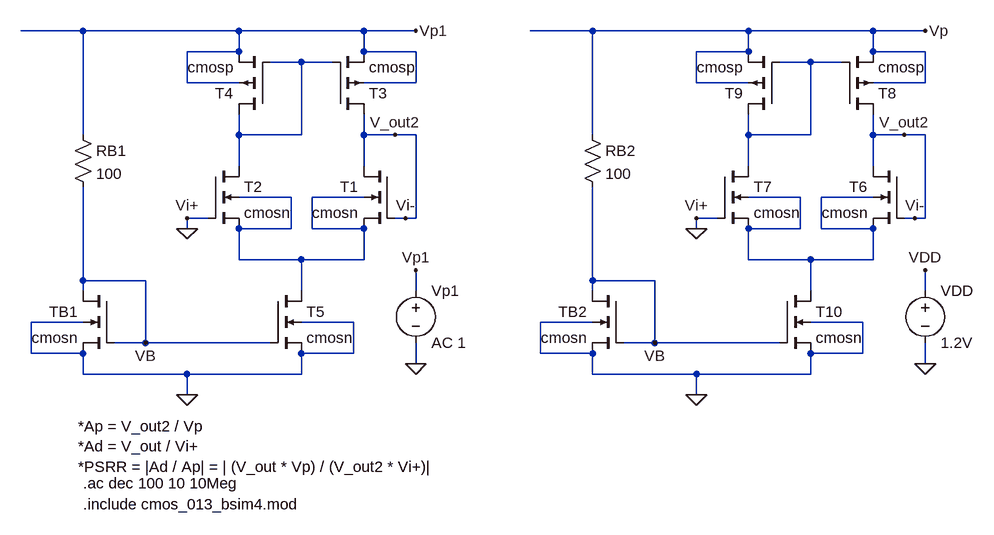
[diagram p0: schematic Draft1.asc]
Draft1.asc, the LTspice schematic file:
Version 4
SHEET 1 1296 680
WIRE -128 -224 -224 -224
WIRE 112 -224 -128 -224
WIRE 304 -224 112 -224
WIRE 384 -224 304 -224
WIRE 656 -224 560 -224
WIRE 896 -224 656 -224
WIRE 1088 -224 896 -224
WIRE 1168 -224 1088 -224
WIRE 112 -192 112 -224
WIRE 112 -192 32 -192
WIRE 304 -192 304 -224
WIRE 384 -192 304 -192
WIRE 896 -192 896 -224
WIRE 896 -192 816 -192
WIRE 1088 -192 1088 -224
WIRE 1168 -192 1088 -192
WIRE 208 -176 160 -176
WIRE 256 -176 208 -176
WIRE 992 -176 944 -176
WIRE 1040 -176 992 -176
WIRE 32 -144 32 -192
WIRE 112 -144 32 -144
WIRE 384 -144 384 -192
WIRE 384 -144 304 -144
WIRE 816 -144 816 -192
WIRE 896 -144 816 -144
WIRE 1168 -144 1168 -192
WIRE 1168 -144 1088 -144
WIRE -128 -64 -128 -224
WIRE 112 -64 112 -96
WIRE 208 -64 208 -176
WIRE 208 -64 112 -64
WIRE 304 -64 304 -96
WIRE 352 -64 304 -64
WIRE 384 -64 352 -64
WIRE 656 -64 656 -224
WIRE 896 -64 896 -96
WIRE 992 -64 992 -176
WIRE 992 -64 896 -64
WIRE 1088 -64 1088 -96
WIRE 1136 -64 1088 -64
WIRE 1168 -64 1136 -64
WIRE 112 -16 112 -64
WIRE 304 -16 304 -64
WIRE 896 -16 896 -64
WIRE 1088 -16 1088 -64
WIRE 192 32 112 32
WIRE 304 32 224 32
WIRE 976 32 896 32
WIRE 1088 32 1008 32
WIRE 64 64 32 64
WIRE 368 64 352 64
WIRE 384 64 384 -64
WIRE 384 64 368 64
WIRE 848 64 816 64
WIRE 1152 64 1136 64
WIRE 1168 64 1168 -64
WIRE 1168 64 1152 64
WIRE 32 80 32 64
WIRE 192 80 192 32
WIRE 192 80 112 80
WIRE 224 80 224 32
WIRE 304 80 224 80
WIRE 816 80 816 64
WIRE 976 80 976 32
WIRE 976 80 896 80
WIRE 1008 80 1008 32
WIRE 1088 80 1008 80
WIRE 112 128 112 80
WIRE 208 128 112 128
WIRE 304 128 304 80
WIRE 304 128 208 128
WIRE 896 128 896 80
WIRE 992 128 896 128
WIRE 1088 128 1088 80
WIRE 1088 128 992 128
WIRE -128 160 -128 16
WIRE -32 160 -128 160
WIRE 656 160 656 16
WIRE 752 160 656 160
WIRE -128 176 -128 160
WIRE 208 176 208 128
WIRE 384 176 384 144
WIRE 656 176 656 160
WIRE 992 176 992 128
WIRE 1168 176 1168 144
WIRE -128 224 -208 224
WIRE 288 224 208 224
WIRE 656 224 576 224
WIRE 1072 224 992 224
WIRE -32 256 -32 160
WIRE -32 256 -80 256
WIRE 160 256 -32 256
WIRE 752 256 752 160
WIRE 752 256 704 256
WIRE 944 256 752 256
WIRE -208 272 -208 224
WIRE -128 272 -208 272
WIRE 288 272 288 224
WIRE 288 272 208 272
WIRE 576 272 576 224
WIRE 656 272 576 272
WIRE 1072 272 1072 224
WIRE 1072 272 992 272
WIRE 384 288 384 256
WIRE 1168 288 1168 256
WIRE -128 304 -128 272
WIRE 32 304 -128 304
WIRE 208 304 208 272
WIRE 208 304 32 304
WIRE 656 304 656 272
WIRE 816 304 656 304
WIRE 992 304 992 272
WIRE 992 304 816 304
WIRE 32 336 32 304
WIRE 816 336 816 304
FLAG 384 -224 Vp1
FLAG 384 288 0
FLAG 384 144 Vp1
FLAG 352 -64 V_out2
FLAG -32 256 VB
FLAG 32 336 0
FLAG 32 80 0
FLAG 32 64 Vi+
FLAG 368 64 Vi-
FLAG 1168 -224 Vp
FLAG 1168 288 0
FLAG 1168 144 VDD
FLAG 1136 -64 V_out2
FLAG 752 256 VB
FLAG 816 336 0
FLAG 816 80 0
FLAG 816 64 Vi+
FLAG 1152 64 Vi-
SYMBOL nmos4 352 -16 M0
SYMATTR InstName T1
SYMATTR Value cmosn
SYMATTR Value2 l=0.13u w=10u
SYMBOL nmos4 64 -16 R0
SYMATTR InstName T2
SYMATTR Value cmosn
SYMATTR Value2 l=0.13u w=10u
SYMBOL pmos4 256 -96 M180
SYMATTR InstName T3
SYMATTR Value cmosp
SYMATTR Value2 l=0.13u w=30u
SYMBOL pmos4 160 -96 R180
SYMATTR InstName T4
SYMATTR Value cmosp
SYMATTR Value2 l=0.13u w=30u
SYMBOL voltage 384 160 R0
WINDOW 123 0 0 Left 0
WINDOW 39 0 0 Left 0
SYMATTR InstName Vp1
SYMATTR Value AC 1
SYMBOL nmos4 160 176 R0
SYMATTR InstName T5
SYMATTR Value cmosn
SYMATTR Value2 l=0.13u w=10u
SYMBOL nmos4 -80 176 M0
SYMATTR InstName TB1
SYMATTR Value cmosn
SYMATTR Value2 l=0.13u w=10u
SYMBOL res -144 -80 R0
SYMATTR InstName RB1
SYMATTR Value 100
SYMBOL nmos4 1136 -16 M0
SYMATTR InstName T6
SYMATTR Value cmosn
SYMATTR Value2 l=0.13u w=10u
SYMBOL nmos4 848 -16 R0
SYMATTR InstName T7
SYMATTR Value cmosn
SYMATTR Value2 l=0.13u w=10u
SYMBOL pmos4 1040 -96 M180
SYMATTR InstName T8
SYMATTR Value cmosp
SYMATTR Value2 l=0.13u w=30u
SYMBOL pmos4 944 -96 R180
SYMATTR InstName T9
SYMATTR Value cmosp
SYMATTR Value2 l=0.13u w=30u
SYMBOL voltage 1168 160 R0
WINDOW 123 0 0 Left 0
WINDOW 39 0 0 Left 0
SYMATTR InstName VDD
SYMATTR Value 1.2V
SYMBOL nmos4 944 176 R0
SYMATTR InstName T10
SYMATTR Value cmosn
SYMATTR Value2 l=0.13u w=10u
SYMBOL nmos4 704 176 M0
SYMATTR InstName TB2
SYMATTR Value cmosn
SYMATTR Value2 l=0.13u w=10u
SYMBOL res 640 -80 R0
SYMATTR InstName RB2
SYMATTR Value 100
TEXT -136 384 Left 2 !*Ap = V_out2 / Vp\n*Ad = V_out / Vi+\n*PSRR = |Ad / Ap| = | (V_out * Vp) / (V_out2 * Vi+)|
TEXT -128 472 Left 2 !.ac dec 100 10 10Meg
TEXT -128 504 Left 2 !.include cmos_013_bsim4.mod

The netlist it stands for:
* Draft1.asc
M§T1 Vi- Vi- N003 N003 cmosn l=0.13u w=10u
M§T2 N001 0 N003 N003 cmosn l=0.13u w=10u
M§T3 Vi- N001 Vp1 Vp1 cmosp l=0.13u w=30u
M§T4 N001 N001 Vp1 Vp1 cmosp l=0.13u w=30u
Vp1 Vp1 0 AC 1
M§T5 N003 VB 0 0 cmosn l=0.13u w=10u
M§TB1 VB VB 0 0 cmosn l=0.13u w=10u
RB1 Vp1 VB 100
M§T6 Vi- Vi- N004 N004 cmosn l=0.13u w=10u
M§T7 N002 0 N004 N004 cmosn l=0.13u w=10u
M§T8 Vi- N002 Vp Vp cmosp l=0.13u w=30u
M§T9 N002 N002 Vp Vp cmosp l=0.13u w=30u
VDD VDD 0 1.2V
M§T10 N004 VB 0 0 cmosn l=0.13u w=10u
M§TB2 VB VB 0 0 cmosn l=0.13u w=10u
RB2 Vp VB 100
.model NMOS NMOS
.model PMOS PMOS
.lib standard.mos
*Ap = V_out2 / Vp
*Ad = V_out / Vi+
*PSRR = |Ad / Ap| = | (V_out * Vp) / (V_out2 * Vi+)|
.ac dec 100 10 10Meg
.include cmos_013_bsim4.mod
.backanno
.end